# Altium schematic sheet 21.SchDoc
size 513 x 386 mm
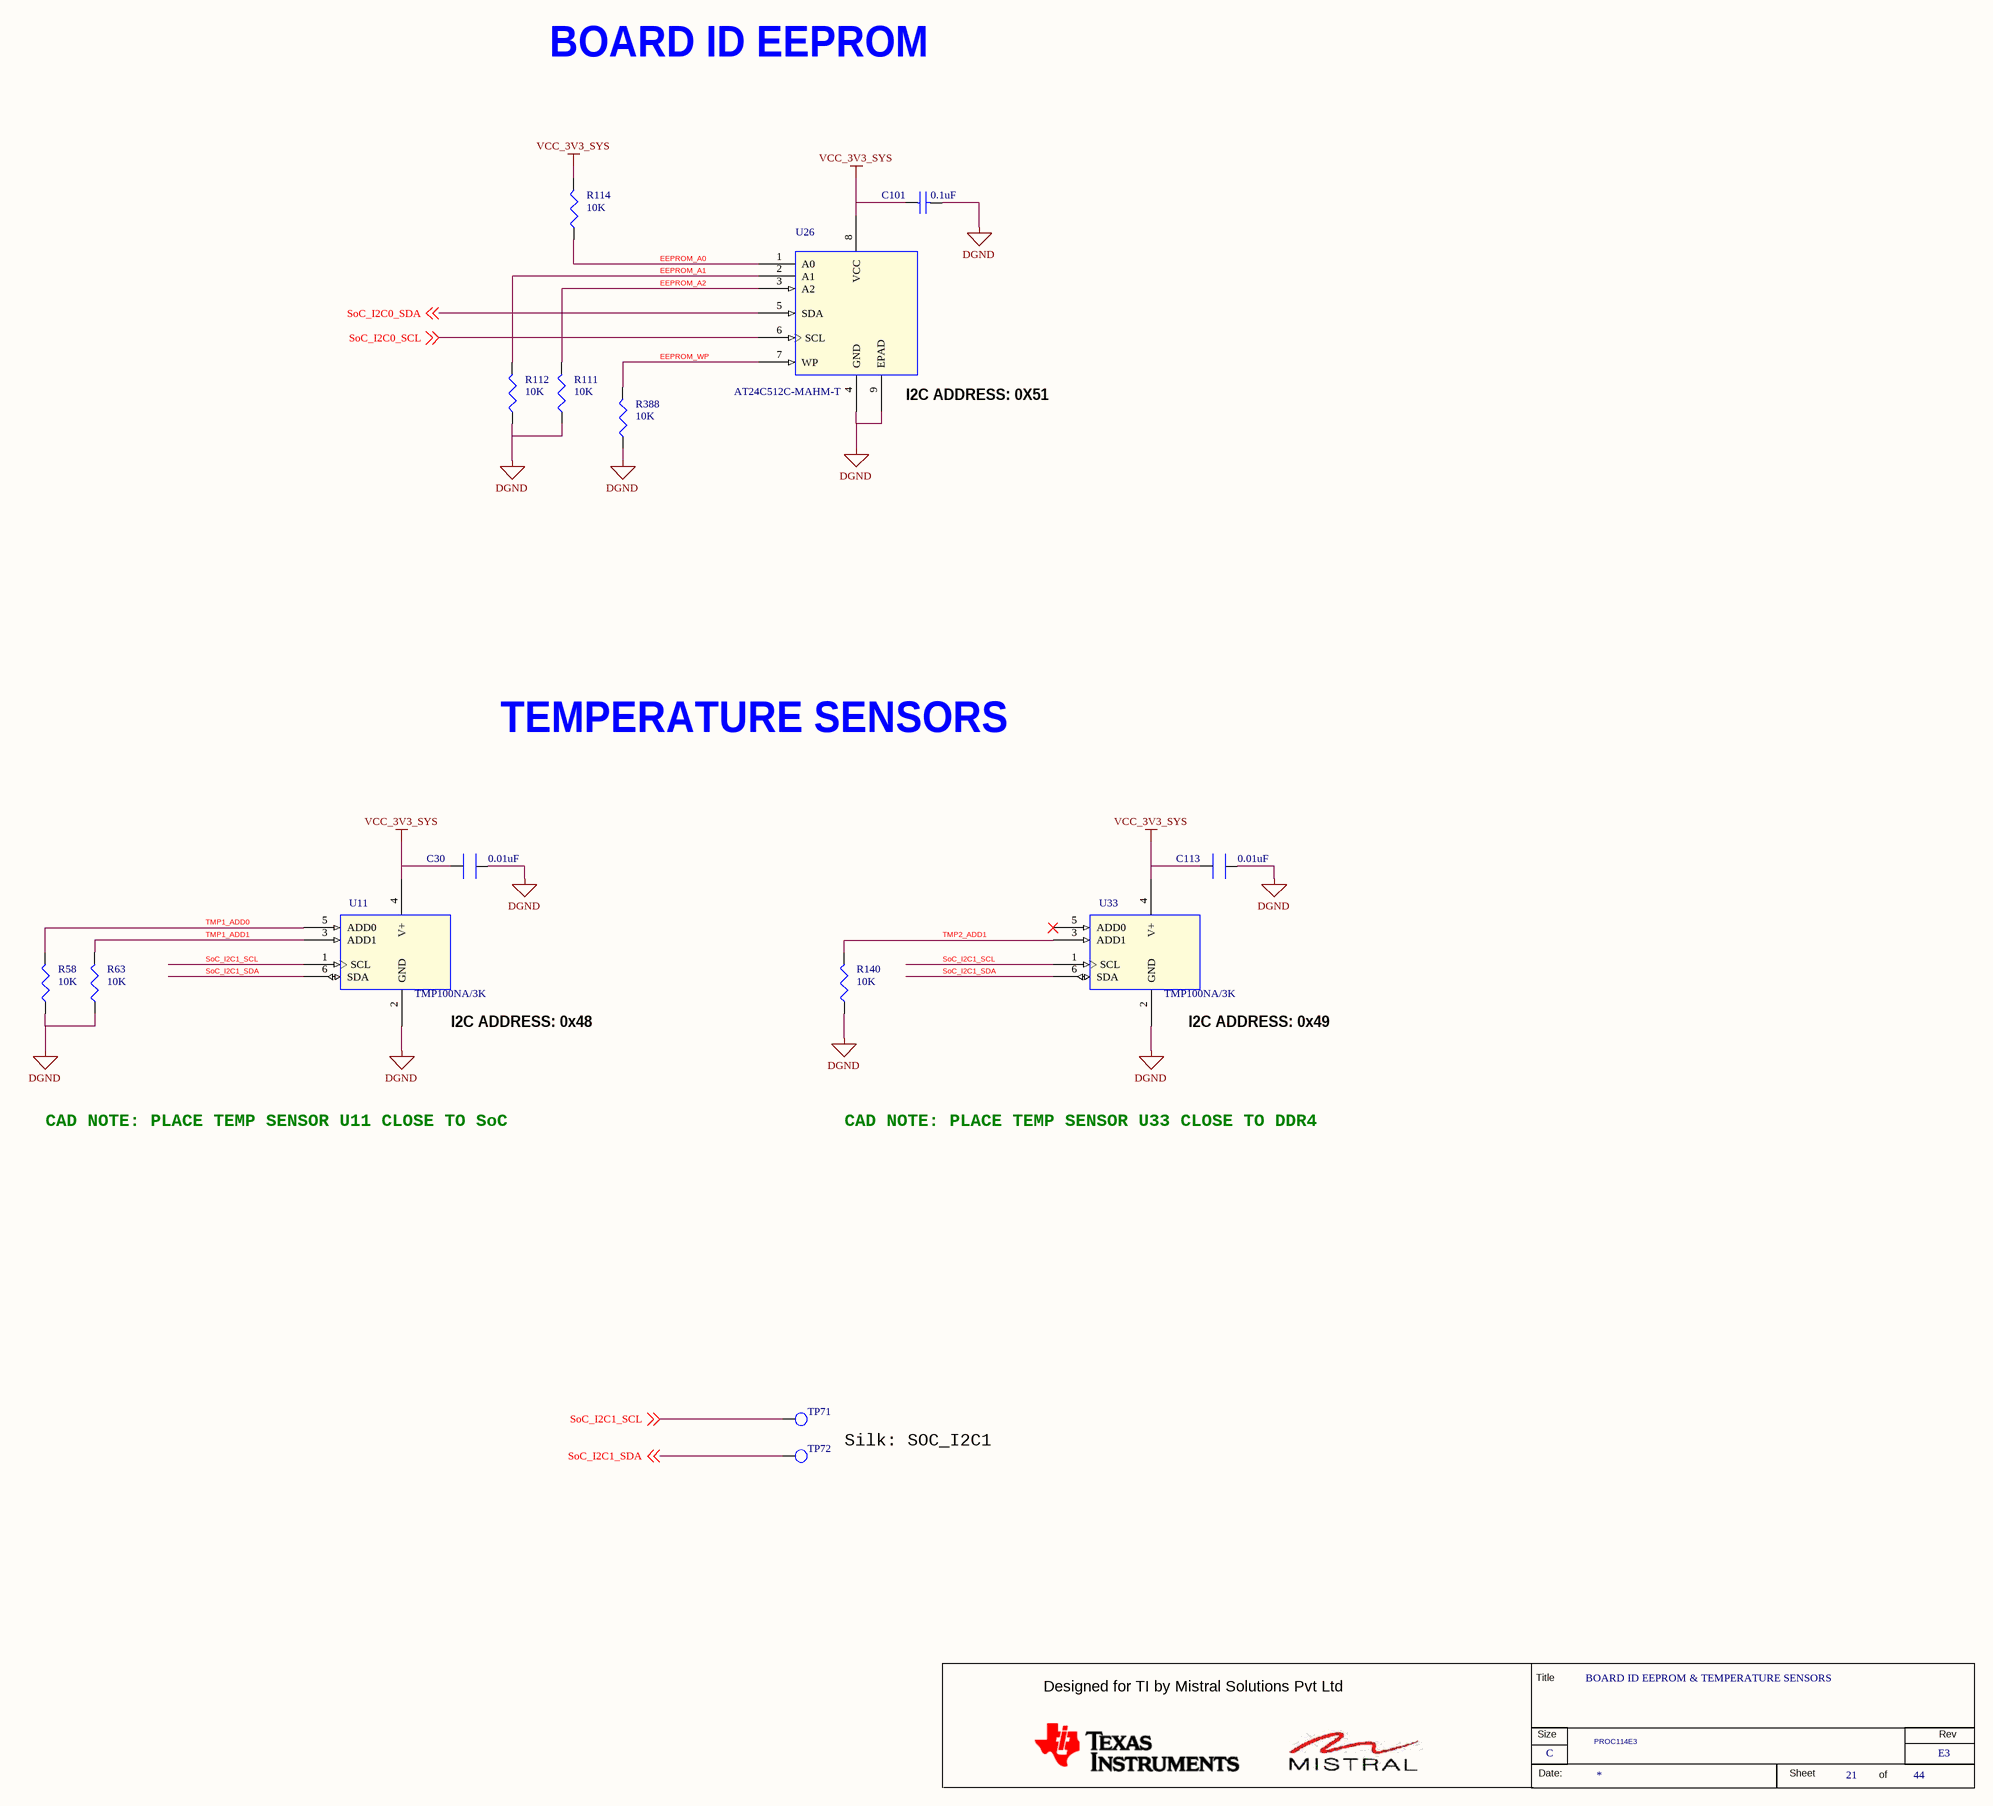
[diagram p0: 21.SchDoc]

## Parts
*  RevCode: E3  Title: BOARD ID EEPROM & TEMPERATURE SENSORS  Page Size: C  Page Number: 21  Page Count: 44  Variant Name: PROC114E3  (hidden comment: MISTRAL_TITLEBLK_CSIZE)  (graphical)
C30  0.01uF  [CAP0402N]
C101  0.1uF  [CAP0402_0-75]
C113  0.01uF  [CAP0402N]
R58  10K  [RES0201_0-5]
R63  10K  [RES0201_0-5]
R111  10K  [RES0201_0-5]
R112  10K  [RES0201_0-5]
R114  10K  [RES0201_0-5]
R140  10K  [RES0201_0-5]
R388  10K  [RES0201_0-5]
TP71  THRU HOLE  [TP_36X22]  (value not drawn)
TP72  THRU HOLE  [TP_36X22]  (value not drawn)
U11  TMP100NA/3K  [SOT23-6_1-5]
U26  AT24C512C-MAHM-T  [UDFN8_19-68_120X80_0-6]
U33  TMP100NA/3K  [SOT23-6_1-5]

## Nets
DGND: C30.1 C101.2 C113.1 R58.2 R63.2 R111.2 R112.2 R140.2 R388.2 U11.2(GND) U26.4(GND) U26.9(EPAD) U33.2(GND)
VCC_3V3_SYS: C30.2 C101.1 C113.2 R114.1 U11.4(V+) U26.8(VCC) U33.4(V+)
EEPROM_A0: R114.2 U26.1(A0)
EEPROM_A1: R112.1 U26.2(A1)
EEPROM_A2: R111.1 U26.3(A2)
EEPROM_WP: R388.1 U26.7(WP)
SoC_I2C0_SCL: U26.6(SCL) ; off-sheet SoC_I2C0_SCL
SoC_I2C0_SDA: U26.5(SDA) ; off-sheet SoC_I2C0_SDA
SoC_I2C1_SCL: TP71.1(TP) U11.1(SCL) U33.1(SCL) ; off-sheet SoC_I2C1_SCL
SoC_I2C1_SDA: TP72.1(TP) U11.6(SDA) U33.6(SDA) ; off-sheet SoC_I2C1_SDA
TMP1_ADD0: R58.1 U11.5(ADD0)
TMP1_ADD1: R63.1 U11.3(ADD1)
TMP2_ADD1: R140.1 U33.3(ADD1)

Not connected (* = marked no-connect by the designer): U33 5(ADD0)*

## Notes on the sheet
- BOARD ID EEPROM
- (near U26) I2C ADDRESS: 0X51
- TEMPERATURE SENSORS
- I2C ADDRESS: 0x48
- (near U33) I2C ADDRESS: 0x49
- CAD NOTE: PLACE TEMP SENSOR U11 CLOSE TO SoC
- CAD NOTE: PLACE TEMP SENSOR U33 CLOSE TO DDR4
- Silk: SOC_I2C1
- (in symbol MISTRAL_TITLEBLK_CSIZE) Title; Designed for TI by Mistral Solutions Pvt Ltd; Size; Rev; Date:; Sheet; of

## Library data of the parts
* = MISTRAL_TITLEBLK_CSIZE: Issue: 1.0; Page Create Date: March  8, 1995; Page Modify Date: *; Schematic Page Count: 44; Schematic Page Number: 21
C30 = CAP_Dup3: CAP CERAMIC 0.01uF 25V 10% X5R 0201; Part_type: CAPACITORS\CERAMIC; Mfr_part_number: GRM033R61E103KA12J; Mfr_name: MURATA; Mistral Part No: 120018010007-R; PCB Footprint: CAP0201_0-5; Wattage: NA; Custom_Duty: 15%; Customs_HS_Code: 85322990; Project: TI_MAXIE_CPB; Footprint Path: Y:\MIS_DATABASE\Library\ALTIUM_TOOL\PCB_FOOTPRINTS\Altium_Footprint_Lib.PcbLib; Library Path: Y:\MIS_DATABASE\Library\ALTIUM_TOOL\SCHEMATICS_PARTS\MS_DISCRETE_Library.schlib; Footprint Ref: CAP0201_0-5; MECHANICAL 3D STEP FILE: CAP0201_0-5; Temperature: -55°C+85°C; Weight: 0.33mg; Chkd/date: MANIRAJA/230118; Crtd /date: MANIRAJA/230118; Datasheet: Y:\MIS_DATABASE\DATASHEETS\CAPACITORS\GRM033R61E103KA12.PDF; Height: 0.33MM; Distributor_part_number: GRM033R61E103KA12J-ND; Distributor_name: DIGIKEY; Package: 0201; Voltage: 25V; Tolerance: 10%; Library Ref: CAP
C101 = CAP_Dup2: CAP CERAMIC 0.1uF 50V 10% X7R 0402; Alt_Mfr_name: YAGEO AMERICA; Part_type: CAPACITORS\CERAMIC; Mfr_part_number: GRM155R71H104KE14D; Mfr_name: MURATA; Mistral Part No: 120011100014-R; Alt_Mfr_part_number: CC0402KRX5R8BB104; Custom_Duty: 15%; Customs_HS_Code: 85322990; Wattage: NA; Project: J7_CP; PCB Footprint: CAP0402_0-75; Footprint Path: Y:\MIS_DATABASE\Library\ALTIUM_TOOL\PCB_FOOTPRINTS\Altium_Footprint_Lib.PcbLib; Library Path: Y:\MIS_DATABASE\Library\ALTIUM_TOOL\SCHEMATICS_PARTS\MS_DISCRETE_Library.schlib; Footprint Ref: CAP0402_0-75; Library Ref: CAP; MECHANICAL 3D STEP FILE: CAP0402_0-75; Chkd/date: MANIRAJA/261020; Crtd /date: ALVY/211020; Datasheet: Y:\MIS_DATABASE\DATASHEETS\CAPACITORS\GRM155R71H104KE14.PDF; Temperature: -55°C+125°C; Weight: 3.1mg; Height: 0.55MM; Distributor_part_number: 490-10700-1-ND; Distributor_name: DIGIKEY; Package: 0402; Voltage: 50V; Tolerance: 10%
C113 = CAP_Dup3: CAP CERAMIC 0.01uF 25V 10% X5R 0201; Mistral Part No: 120018010007-R; Mfr_name: MURATA; Mfr_part_number: GRM033R61E103KA12J; Part_type: CAPACITORS\CERAMIC; PCB Footprint: CAP0201_0-5; Project: TI_MAXIE_CPB; Customs_HS_Code: 85322990; Custom_Duty: 15%; Wattage: NA; Library Ref: CAP; Tolerance: 10%; Voltage: 25V; Package: 0201; Distributor_name: DIGIKEY; Distributor_part_number: GRM033R61E103KA12J-ND; Height: 0.33MM; Datasheet: Y:\MIS_DATABASE\DATASHEETS\CAPACITORS\GRM033R61E103KA12.PDF; Crtd /date: MANIRAJA/230118; Chkd/date: MANIRAJA/230118; Weight: 0.33mg; Temperature: -55°C+85°C; MECHANICAL 3D STEP FILE: CAP0201_0-5; Footprint Ref: CAP0201_0-5; Library Path: Y:\MIS_DATABASE\Library\ALTIUM_TOOL\SCHEMATICS_PARTS\MS_DISCRETE_Library.schlib; Footprint Path: Y:\MIS_DATABASE\Library\ALTIUM_TOOL\PCB_FOOTPRINTS\Altium_Footprint_Lib.PcbLib
R58 R63 R111 R114 R388 = RESISTOR_Dup6: RES 10K 1/20W 5% 0201; Part_type: RESISTORS\FIXED; Mfr_part_number: RC0201JR-0710KL; Mfr_name: YAGEO AMERICA; Mistral Part No: 110010070051-R; Custom_Duty: 15%; Customs_HS_Code: 85332119; Voltage: NA; Project: GOLDEN-I LITE; PCB Footprint: RES0201_0-5; Footprint Path: Y:\MIS_DATABASE\Library\ALTIUM_TOOL\PCB_FOOTPRINTS\Altium_Footprint_Lib.PcbLib; Library Path: Y:\MIS_DATABASE\Library\ALTIUM_TOOL\SCHEMATICS_PARTS\MS_DISCRETE_Library.schlib; MECHANICAL 3D STEP FILE: RES0201_0-5; Chkd/date: MANIRAJA/050517; Crtd /date: MANIRAJA/050517; Datasheet: Y:\MIS_DATABASE\DATASHEETS\RESISTORS\RCXXXXL-SER_MAR18.PDF; Temperature: -55°C+125°C; Weight: 0.17mg; Height: 0.26MM; Library Ref: RESISTOR; Distributor_part_number: 311-10KNCT-ND; Distributor_name: DIGIKEY; Package: 0201; Wattage: 1/20W; Tolerance: 5%; Footprint Ref: RES0201_0-5
R112 R140 = RESISTOR_Dup6: RES 10K 1/20W 5% 0201; Mistral Part No: 110010070051-R; Mfr_name: YAGEO AMERICA; Mfr_part_number: RC0201JR-0710KL; Part_type: RESISTORS\FIXED; Project: GOLDEN-I LITE; Voltage: NA; Customs_HS_Code: 85332119; Custom_Duty: 15%; PCB Footprint: RES0201_0-5; Footprint Ref: RES0201_0-5; Tolerance: 5%; Wattage: 1/20W; Package: 0201; Distributor_name: DIGIKEY; Distributor_part_number: 311-10KNCT-ND; Library Ref: RESISTOR; Height: 0.26MM; Weight: 0.17mg; Temperature: -55°C+125°C; Datasheet: Y:\MIS_DATABASE\DATASHEETS\RESISTORS\RCXXXXL-SER_MAR18.PDF; Crtd /date: MANIRAJA/050517; Chkd/date: MANIRAJA/050517; MECHANICAL 3D STEP FILE: RES0201_0-5; Library Path: Y:\MIS_DATABASE\Library\ALTIUM_TOOL\SCHEMATICS_PARTS\MS_DISCRETE_Library.schlib; Footprint Path: Y:\MIS_DATABASE\Library\ALTIUM_TOOL\PCB_FOOTPRINTS\Altium_Footprint_Lib.PcbLib
TP71 TP72 = TESTPOINT: TESTPOINT 0.56MM DRILL PTH; Mistral Part No: 130010010008; Mfr_name: LOCAL; Wattage: NA; Project: KOPIN_MODULS; PCB Footprint: TP_36X22; Temperature: NA; Weight: NA; Voltage: NA; Tolerance: NA; Mfr_part_number: TP_36X22; Part_type: TESTPOINT; Package: THRU-HOLE; Distributor_name: NA; Distributor_part_number: NA; Height: NA; Crtd /date: MAZHAR/110405; Chkd/date: BAVISH/040311; Datasheet: NA; Library Ref: TESTPOINT
U11 = TMP100NA/3K_SOT23-6: IC TEMPERATURE SENSOR WITH I2C AND SMBUS INTERFACE SOT23-6; Mistral Part No: 141017080030-R; Mfr_name: TEXAS INSTRUMENTS; Part_type: ICS\DIGITAL\PERIPHERAL; Project: TI_MAXIE_CPB; Tolerance: NA; Customs_HS_Code: 85423100; Custom_Duty: 15%; PCB Footprint: SOT23-6_1-5; Library Ref: TMP100NA/3K_SOT23-6; Mfr_part_number: TMP100NA/3K; Voltage: NA; Wattage: NA; Package: SOT23-6; Distributor_name: DIGIKEY; Distributor_part_number: 296-26833-1-ND; Height: 1.45MM; Weight: 120mg; Temperature: -55°C+125°C; Datasheet: Y:\MIS_DATABASE\DATASHEETS\ICS\DIGITAL\PERIPHERAL\TMP10XX.PDF; Crtd /date: MANIRAJA/290817; Chkd/date: MANIRAJA/290817; MECHANICAL 3D STEP FILE: SOT23-6_1-5
U26 = AT24C64D-MAHM-T_UDFN8: IC 1.7-3.6V 512Kb I2C COMPATIBLE SERIAL EEPROM UDFN8; Mistral Part No: 141119090004-R; Mfr_name: MICROCHIP; Part_type: ICS\DIGITAL\MEMORY; Project: HAL_3U-T1042-SBC; Tolerance: NA; Customs_HS_Code: 85423100; Custom_Duty: 15%; PCB Footprint: UDFN8_19-68_120X80_0-6; Mfr_part_number: AT24C512C-MAHM-T; Voltage: NA; Wattage: NA; Package: UDFN8; Distributor_name: DIGIKEY; Distributor_part_number: AT24C512C-MAHM-TCT-ND; Library Ref: AT24C64D-MAHM-T_UDFN8; Footprint Ref: UDFN8_19-68_120X80_0-6; Height: 0.60MM; Weight: 9.5mg; Temperature: -40°C+85°C; Datasheet: Y:\MIS_DATABASE\DATASHEETS\ICS\MEMORY\AT24C512C.PDF; Crtd /date: ALVY/240919; Chkd/date: MANIRAJA/240919; MECHANICAL 3D STEP FILE: UDFN8_19-68_120X80_0-6; Library Path: Y:\MIS_DATABASE\Library\ALTIUM_TOOL\SCHEMATICS_PARTS\MS_MISCMEMORY_Library.schlib; Footprint Path: Y:\MIS_DATABASE\Library\ALTIUM_TOOL\PCB_FOOTPRINTS\Altium_Footprint_Lib.PcbLib
U33 = TMP100NA/3K_SOT23-6: IC TEMPERATURE SENSOR WITH I2C AND SMBUS INTERFACE SOT23-6; Part_type: ICS\DIGITAL\PERIPHERAL; Mfr_name: TEXAS INSTRUMENTS; Mistral Part No: 141017080030-R; Custom_Duty: 15%; Customs_HS_Code: 85423100; Wattage: NA; Project: TI_MAXIE_CPB; PCB Footprint: SOT23-6_1-5; Library Ref: TMP100NA/3K_SOT23-6; MECHANICAL 3D STEP FILE: SOT23-6_1-5; Chkd/date: MANIRAJA/290817; Crtd /date: MANIRAJA/290817; Datasheet: Y:\MIS_DATABASE\DATASHEETS\ICS\DIGITAL\PERIPHERAL\TMP10XX.PDF; Temperature: -55°C+125°C; Weight: 120mg; Height: 1.45MM; Distributor_part_number: 296-26833-1-ND; Distributor_name: DIGIKEY; Package: SOT23-6; Voltage: NA; Tolerance: NA; Mfr_part_number: TMP100NA/3K